# Altium schematic sheet 07_CONNECTORS.SchDoc: =TitleParameter
size A3; Organization: ASISGUARD; Address1: Kemalpasa, Kemalpasa Cd. No:290 D:292H, 35060 Bornova/Izmir/Turkey; SheetNumber: 7; SheetTotal: 12
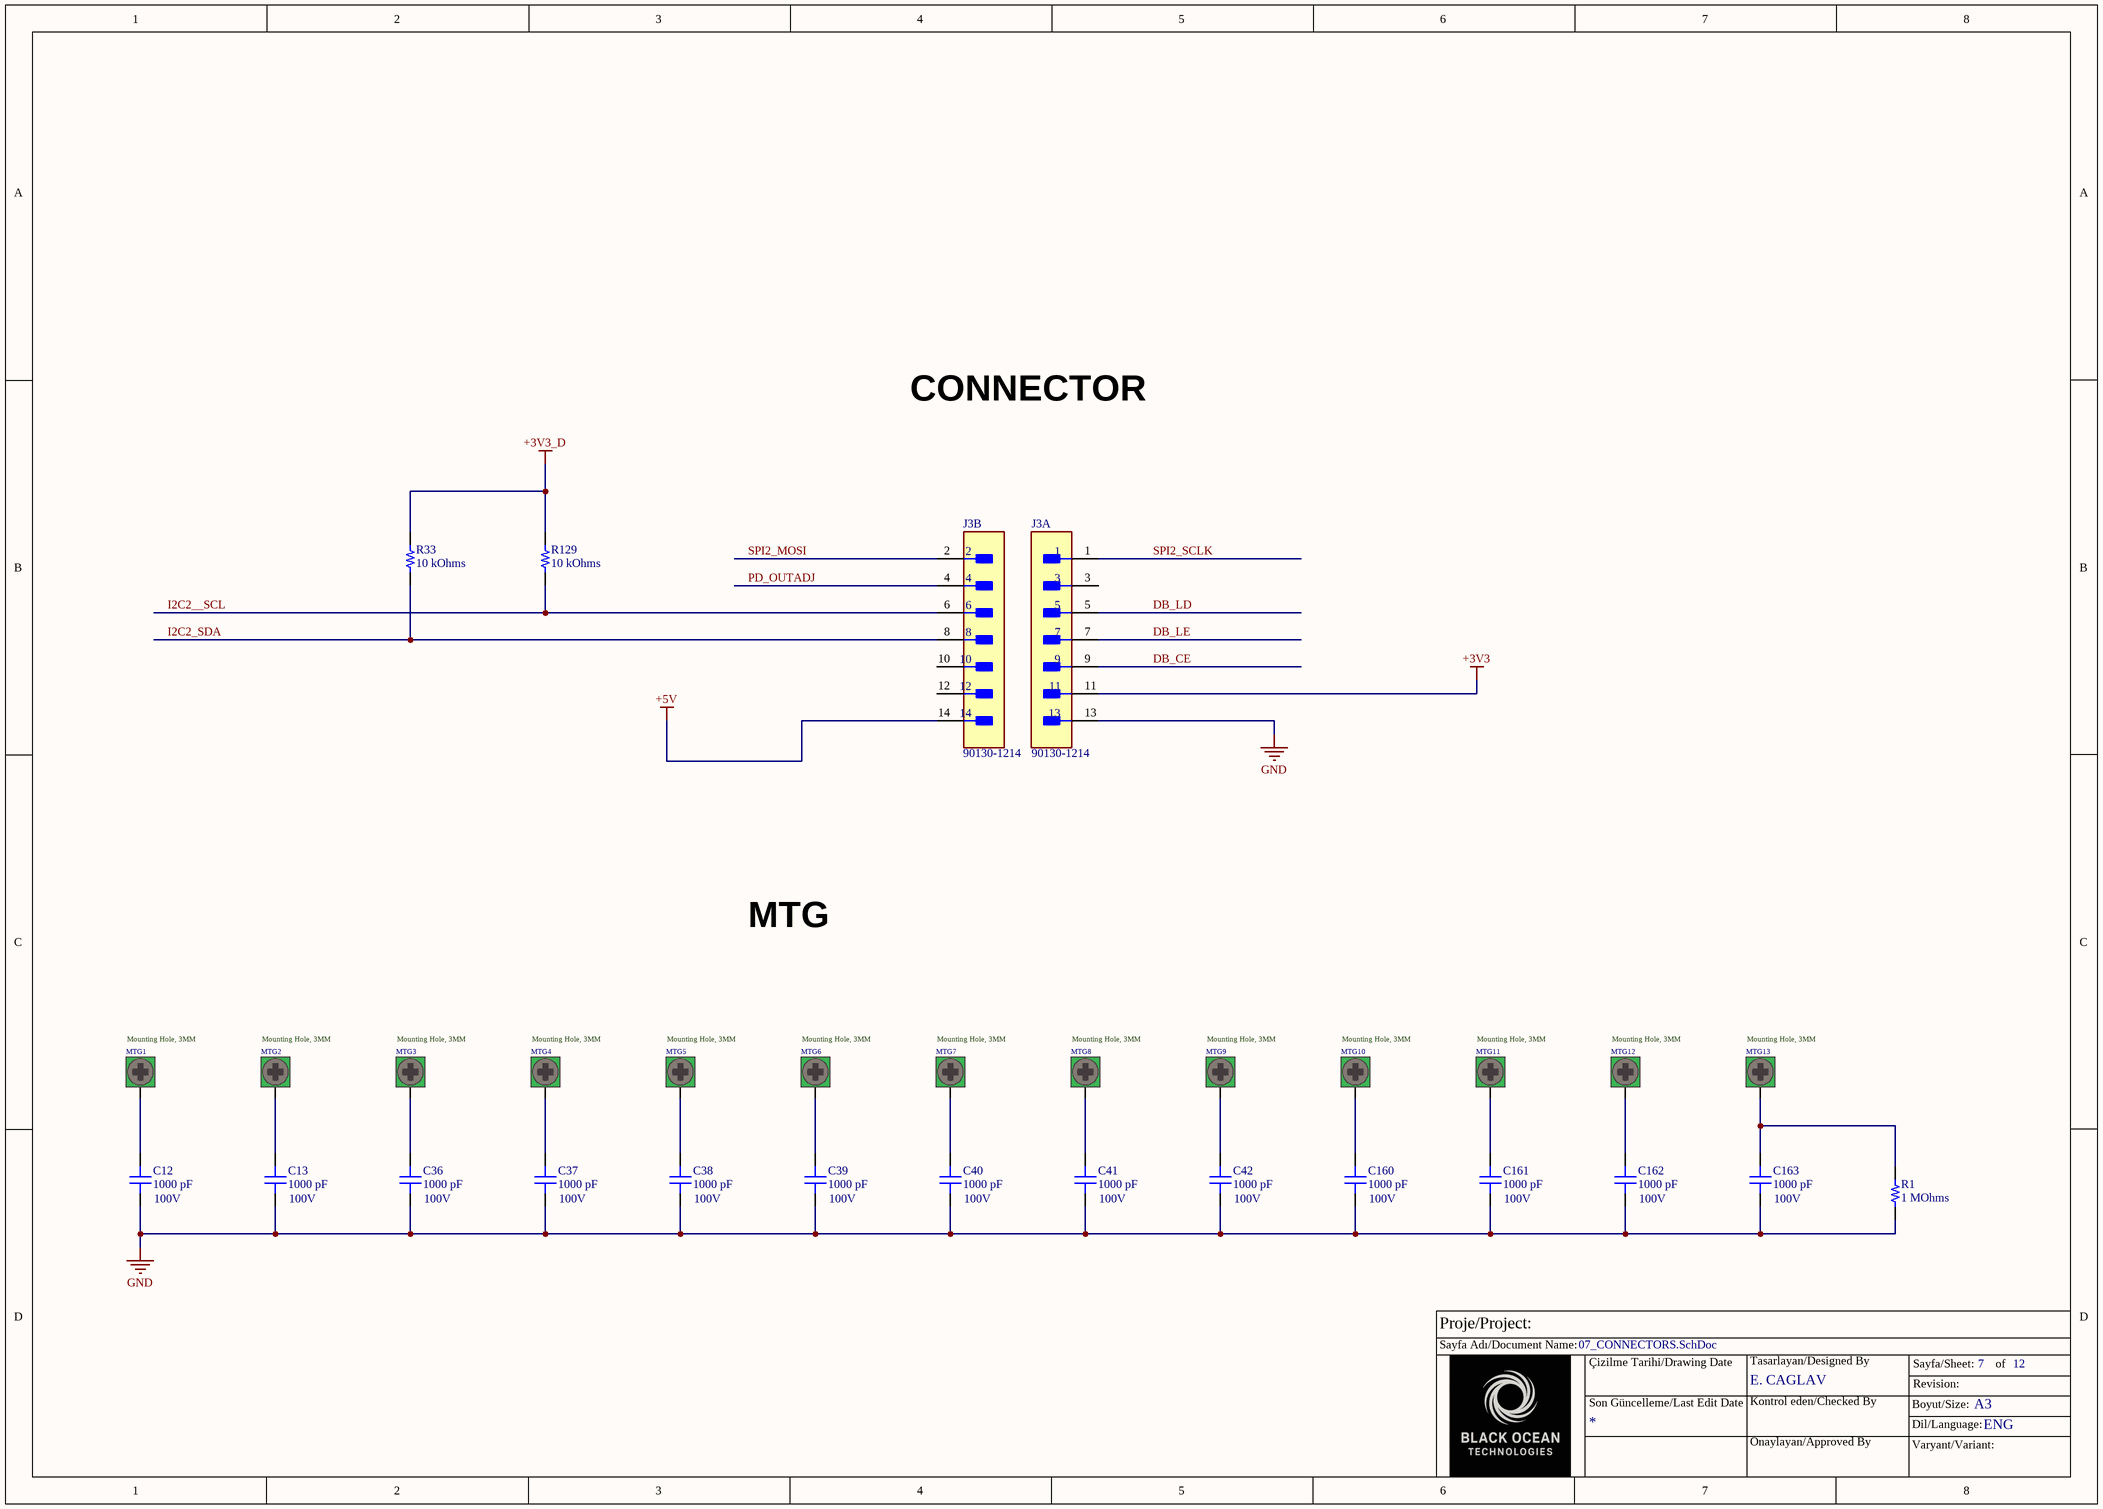
[diagram p0: 07_CONNECTORS.SchDoc]

## Parts
C12  Voltage - Rated: 100V  [CAP 0402_1005]  (hidden comment: 1000 pF)
C13  Voltage - Rated: 100V  [CAP 0402_1005]  (hidden comment: 1000 pF)
C36  Voltage - Rated: 100V  [CAP 0402_1005]  (hidden comment: 1000 pF)
C37  Voltage - Rated: 100V  [CAP 0402_1005]  (hidden comment: 1000 pF)
C38  Voltage - Rated: 100V  [CAP 0402_1005]  (hidden comment: 1000 pF)
C39  Voltage - Rated: 100V  [CAP 0402_1005]  (hidden comment: 1000 pF)
C40  Voltage - Rated: 100V  [CAP 0402_1005]  (hidden comment: 1000 pF)
C41  Voltage - Rated: 100V  [CAP 0402_1005]  (hidden comment: 1000 pF)
C42  Voltage - Rated: 100V  [CAP 0402_1005]  (hidden comment: 1000 pF)
C160  Voltage - Rated: 100V  [CAP 0402_1005]  (hidden comment: 1000 pF)
C161  Voltage - Rated: 100V  [CAP 0402_1005]  (hidden comment: 1000 pF)
C162  Voltage - Rated: 100V  [CAP 0402_1005]  (hidden comment: 1000 pF)
C163  Voltage - Rated: 100V  [CAP 0402_1005]  (hidden comment: 1000 pF)
J3  90130-1214  [FP-90130-1214-MFG]  (parts A,B of 2)
MTG1  Mounting Hole, 3MM  [MTG-PTH-3MM]  (no BOM)
MTG2  Mounting Hole, 3MM  [MTG-PTH-3MM]  (no BOM)
MTG3  Mounting Hole, 3MM  [MTG-PTH-3MM]  (no BOM)
MTG4  Mounting Hole, 3MM  [MTG-PTH-3MM]  (no BOM)
MTG5  Mounting Hole, 3MM  [MTG-PTH-3MM]  (no BOM)
MTG6  Mounting Hole, 3MM  [MTG-PTH-3MM]  (no BOM)
MTG7  Mounting Hole, 3MM  [MTG-PTH-3MM]  (no BOM)
MTG8  Mounting Hole, 3MM  [MTG-PTH-3MM]  (no BOM)
MTG9  Mounting Hole, 3MM  [MTG-PTH-3MM]  (no BOM)
MTG10  Mounting Hole, 3MM  [MTG-PTH-3MM]  (no BOM)
MTG11  Mounting Hole, 3MM  [MTG-PTH-3MM]  (no BOM)
MTG12  Mounting Hole, 3MM  [MTG-PTH-3MM]  (no BOM)
MTG13  Mounting Hole, 3MM  [MTG-PTH-3MM]  (no BOM)
R1  1 MOhms  [RES 0402_1005]
R33  10 kOhms  [RES 0402_1005]
R129  10 kOhms  [RES 0402_1005]

## Nets
+3V3: J3.11
+3V3_D: R33.1 R129.1
+5V: J3.14
GND: C12.1 C13.1 C36.1 C37.1 C38.1 C39.1 C40.1 C41.1 C42.1 C160.1 C161.1 C162.1 C163.1 J3.13 R1.1
DB_CE: J3.9
DB_LD: J3.5
DB_LE: J3.7
I2C2__SCL: J3.6 R129.2
I2C2_SDA: J3.8 R33.2
PD_OUTADJ: J3.4
SPI2_MOSI: J3.2
SPI2_SCLK: J3.1
NetC12_2: C12.2 MTG1.0
NetC13_2: C13.2 MTG2.0
NetC36_2: C36.2 MTG3.0
NetC37_2: C37.2 MTG4.0
NetC38_2: C38.2 MTG5.0
NetC39_2: C39.2 MTG6.0
NetC40_2: C40.2 MTG7.0
NetC41_2: C41.2 MTG8.0
NetC42_2: C42.2 MTG9.0
NetC160_2: C160.2 MTG10.0
NetC161_2: C161.2 MTG11.0
NetC162_2: C162.2 MTG12.0
NetC163_2: C163.2 MTG13.0 R1.2

Not connected (* = marked no-connect by the designer): J3 3 10 12

## Notes on the sheet
- CONNECTOR
- MTG
- Proje/Project:
- Sayfa Adı/Document Name:
- Çizilme Tarihi/Drawing Date
- E. CAGLAV
- Tasarlayan/Designed By
- Sayfa/Sheet:
- Revision:
- of
- Son Güncelleme/Last Edit Date
- Kontrol eden/Checked By
- Onaylayan/Approved By
- Boyut/Size:
- Varyant/Variant:
- Dil/Language:
- A3
- ENG

## Library data of the parts
C12 C13 C36-C42 C160-C163 = C0402H102J1GAC7867: CAP CER 1000PF 100V C0G/NP0 0402; manufacturer: KEMET; Temperature Coefficient: C0G, NP0; Tolerance: ±5%; Part Number: C0402H102J1GAC7867; Capacitance: 1000 pF; Applications: Downhole; componentlink1description: Datasheet; componentlink1url: https://api.kemet.com/component-edge/download/datasheet/C0402H102J1GAC7867.pdf; componentlink2description: DigiKey Link; componentlink2url: https://www.digikey.com/en/products/detail/kemet/C0402H102J1GAC7867/5267578; Device Package: 0402 (1005 Metric); Features: Low ESL, High Temperature; lastupdated: 3/30/2026 7:10:31 PM; Lifecycle Status: Active; Minimum Order: 1; Mounting Type: Surface Mount, MLCC; Operating Temperature: -55°C ~ 200°C; Package / Case: 0402 (1005 Metric); packaging: TapeAndReel; partid: 3822; Part Status: Active; price: 0.24; series: SMD Indust C0G HT200C; Size / Dimension: 0.039" L x 0.020" W (1.00mm x 0.50mm); Supplier 1: DigiKey; Supplier Part Number 1: 399-11931-1-ND; Thickness (Max): 0.022" (0.55mm); value: 1000 pF
J3 = CMP-00257-00655589-1: 90130-1214 Conn Shrouded Header (4 Sides) HDR 14 POS 2.54mm Solder ST Top Entry Thru-Hole C-Grid III™ Tray; NexarPartId: 655589; Voltage Rating (AC): 350V; Gender: Male; Number of Circuits: 14; Connector Type: Male Pin; Mating Post Length: 6.75mm; Lead Length: 2.9mm; Contact Resistance: 20mΩ; Insulation Resistance: 5GΩ; Max Voltage Rating (DC): 350.35kV; Current Rating: 3A; Glow Wire Compliant: Non-compliant; RoHS: Compliant; Schedule B: 8536694040; Voltage Rating (DC): 350V; Lead Free: Lead Free; Row Spacing: 2.54mm; Color: Black; Voltage Rating: 350V; Housing Material: Polyester; Lead Pitch: 2.54mm; Radiation Hardening: No; Working Voltage: 350V; Pitch: 2.54mm; Orientation: Vertical; Housing Color: Black; Contact Material: Brass; Number of Poles: 14; Min Operating Temperature: -55°C; Number of Rows: 2; Termination: Solder; Number of Contacts: 14; Material: Glass, Polyester; Contact Plating: Gold; Number of Positions: 14; Max Operating Temperature: 125°C; Contact Gender: Male; REACH SVHC: No SVHC; Mount: Through Hole; Contact Mating Length: 6.7564mm
MTG1-MTG13 = MTG3MM
R1 = RE0402FRE071ML: RES SMD 1M OHM 1% 1/16W 0402; Manufacturer: Yageo; Power (Watts): 0.063W, 1/16W; Temperature Coefficient: ±50ppm/°C; Part Number: RE0402FRE071ML; Value: 1 MOhms; ComponentLink1Description: Datasheet; ComponentLink1URL: https://www.yageo.com/upload/media/product/productsearch/datasheet/rchip/PYu-RE_105_RoHS_L_7.pdf; ComponentLink2Description: DigiKey Link; ComponentLink2URL: https://www.digikey.com/en/products/detail/yageo/RE0402FRE071ML/5923009; Composition: Thick Film; Device Package: 0402 (1005 Metric); Height - Seated (Max): 0.015" (0.37mm); LastUpdated: 4/6/2026 7:40:51 PM; Lifecycle Status: Active; Minimum Order: 1; Number of Terminations: 2; Operating Temperature: -55°C ~ 155°C; Package / Case: 0402 (1005 Metric); Packaging: CutTape; PartId: 78753; Price: 0.01; Resistance: 1 MOhms; Series: RE; Size / Dimension: 0.039" L x 0.020" W (1.00mm x 0.50mm); Supplier 1: DigiKey; Supplier Part Number 1: 13-RE0402FRE071MLCT-ND; Supplier Device Package: 0402; Tolerance: ±1%
R33 R129 = RC0402FR-0710KL: RES 10K OHM 1% 1/16W 0402; Manufacturer: Yageo; Power (Watts): 0.063W, 1/16W; Temperature Coefficient: ±100ppm/°C; Part Number: RC0402FR-0710KL; Value: 10 kOhms; ComponentLink1Description: Datasheet; ComponentLink1URL: https://www.yageo.com/upload/media/product/productsearch/datasheet/rchip/PYu-RC_Group_51_RoHS_L_10.pdf; ComponentLink2Description: DigiKey Link; ComponentLink2URL: https://www.digikey.com/en/products/detail/yageo/RC0402FR-0710KL/726523; Composition: Thick Film; Device Package: 0402 (1005 Metric); Features: Moisture Resistant; Height - Seated (Max): 0.016" (0.40mm); LastUpdated: 30.04.2023 19:24:29; Lifecycle Status: Active; Minimum Order: 1; Number of Terminations: 2; Operating Temperature: -55°C ~ 155°C; Package / Case: 0402 (1005 Metric); Packaging: CutTape; PartId: 17593; Part Status: Active; Price: 0.01; Resistance: 10 kOhms; Series: RC_L; Size / Dimension: 0.039" L x 0.020" W (1.00mm x 0.50mm); Supplier 1: DigiKey; Supplier Part Number 1: 311-10.0KLRCT-ND; Supplier Device Package: 0402; Tolerance: ±1%